# EasyEDA schematic SCH_jlh1969_2026-03-17.json
TITLE: Sheet_1; REV: 1.0; Date: 2026-02-05; Sheet: 1/1; Drawn By: emilio.mol.mar; Company: Your Company
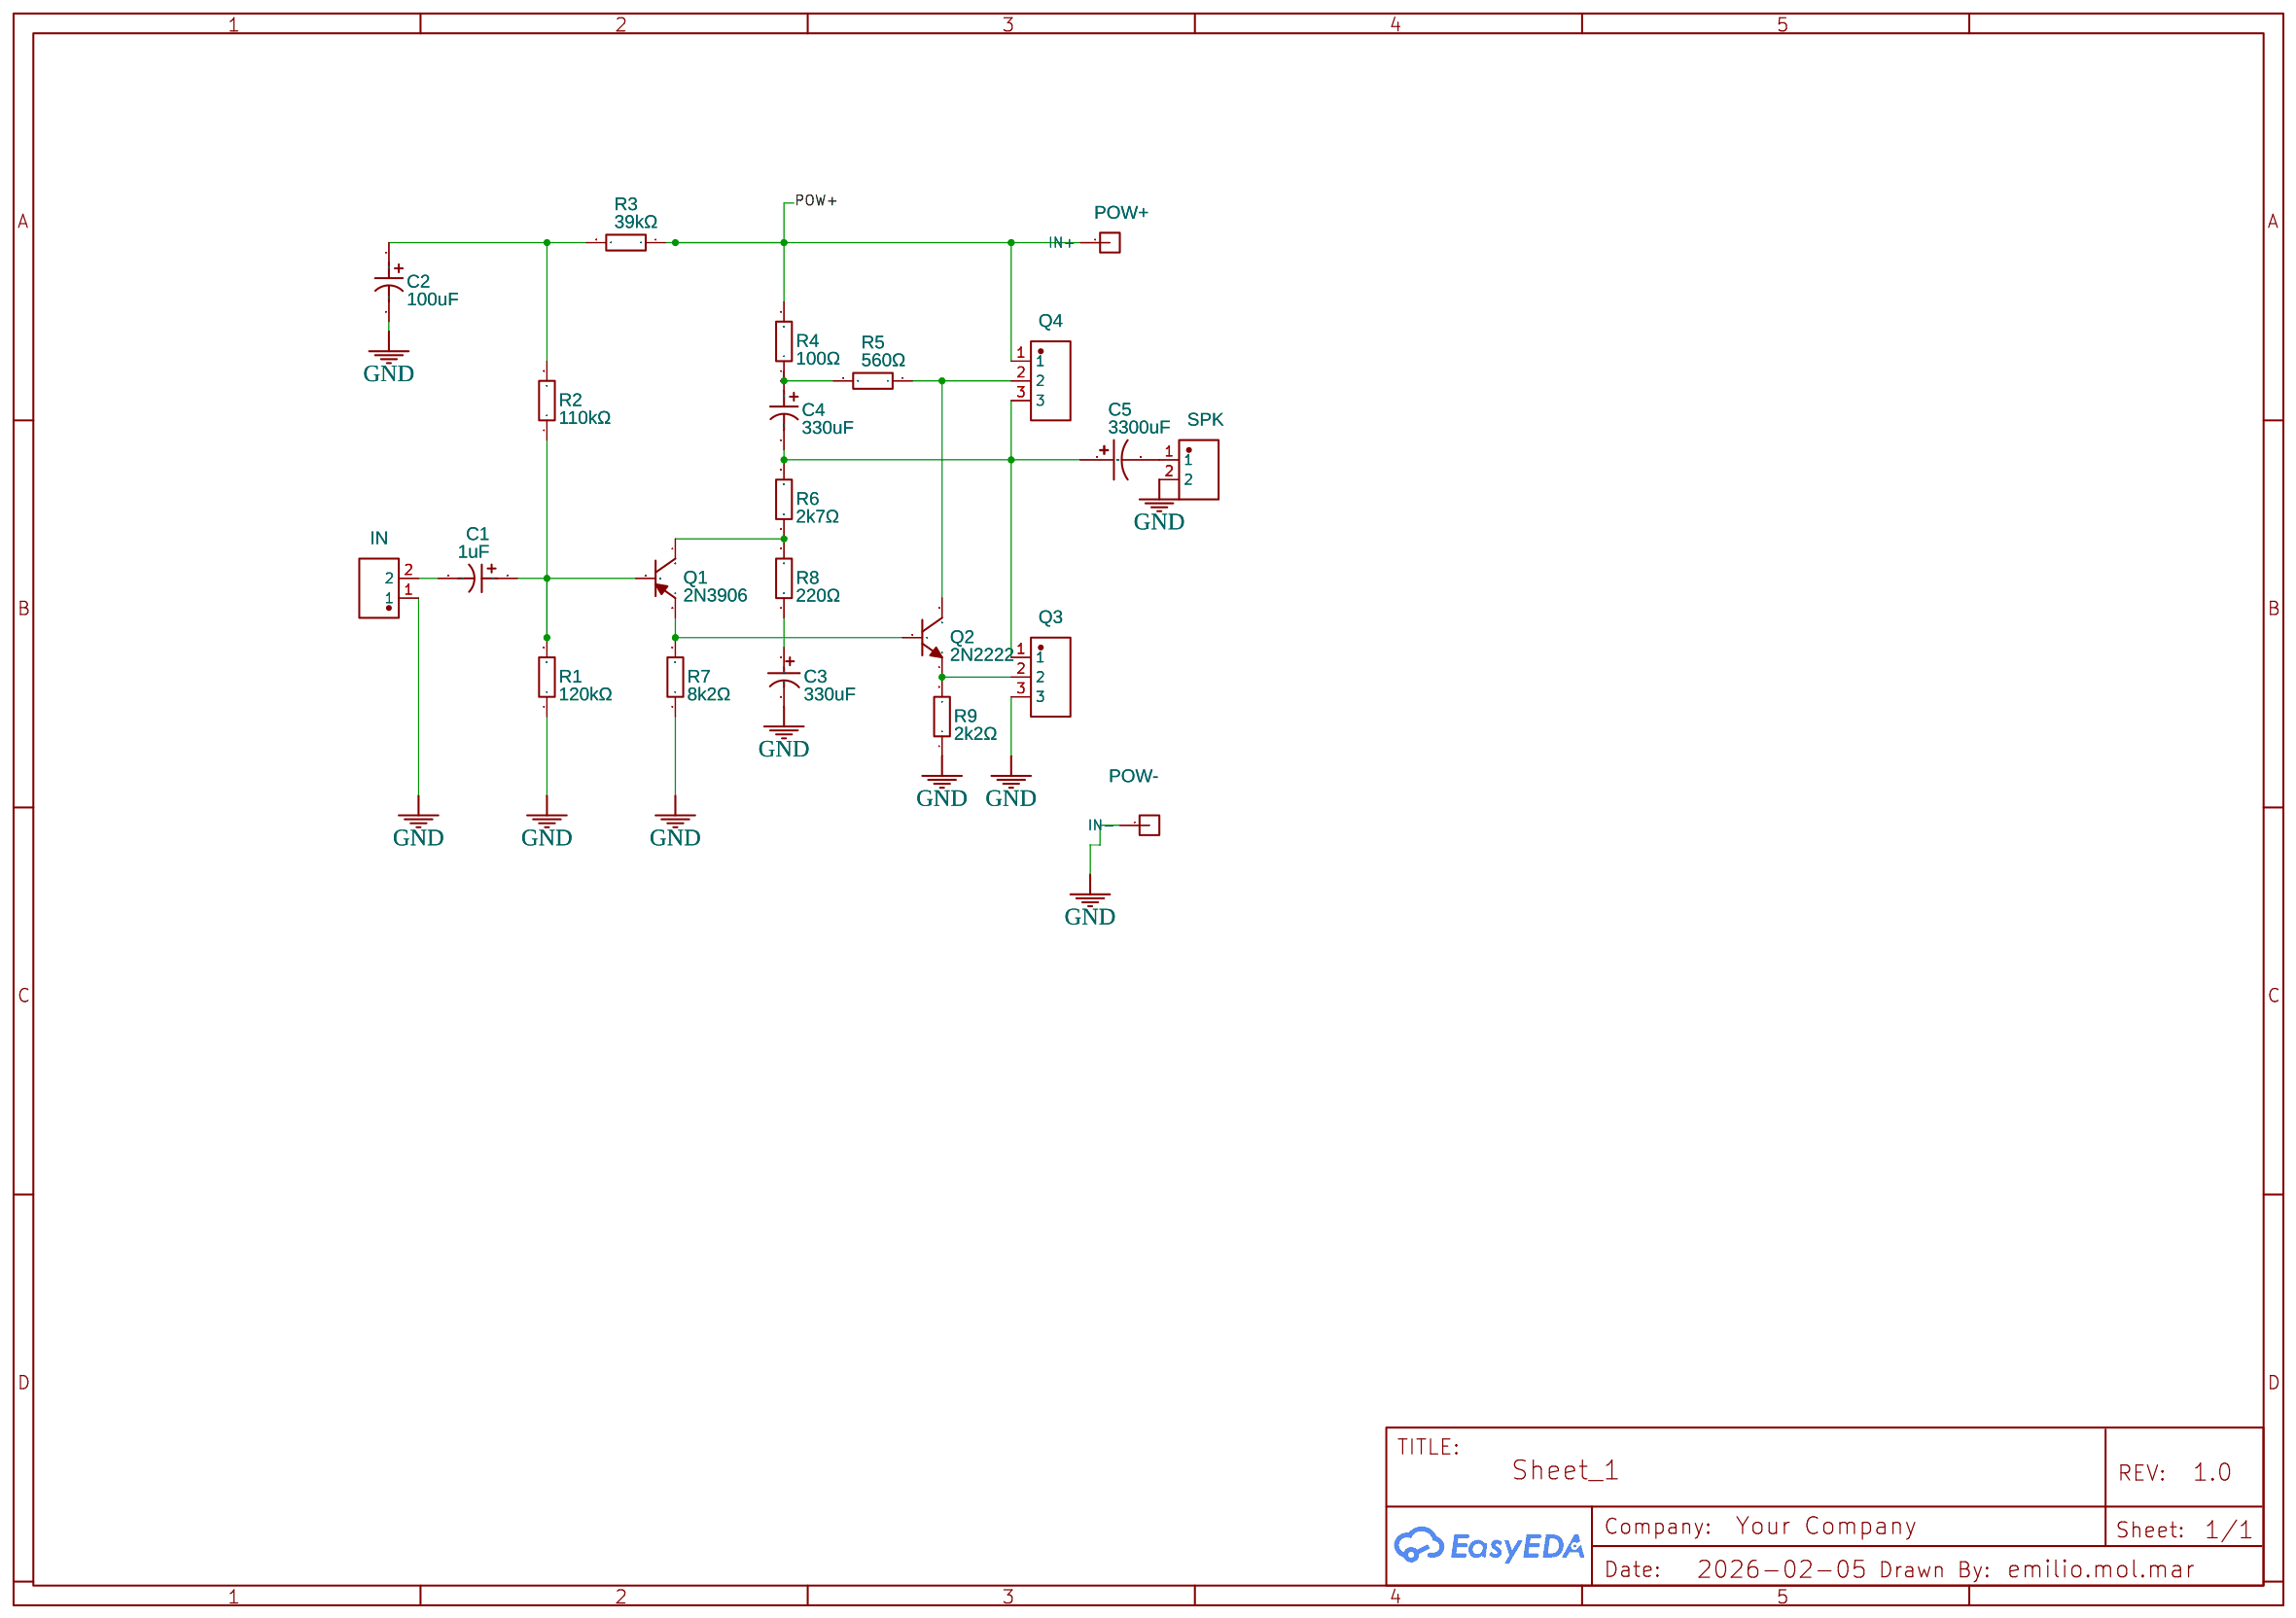
[diagram p0: schematic sheet]

## Parts
C1  1uF  [CAP-TH_BD5.0-P2.00-D0.5-FD-1]
C2  100uF  [CAP-TH_BD6.3-P2.50-D0.6-FD]
C3  330uF  [CAP-TH_BD8.0-P3.50-D0.6-FD]
C4  330uF  [CAP-TH_BD6.3-P2.50-D0.6-FD]
C5  3300uF  [CAP-TH_BD18.0-P7.50-D0.8-FD]
IN  XDZ200-1-02-Z-2.0-G1  [HDR-TH_2P-P2.00-V-M]
POW+  Buck_IN+  [HDR-TH_1P-P2.54-V-M]
POW-  Buck_IN-  [HDR-TH_1P-P2.54-V-M]
Q1  2N3906  [TO-92-3_L4.8-W3.7-P1.27-R-1]
Q2  2N2222  [TO-18-3_BD5.6_L14C1]
Q3  PEC03SAAN_C5708637  [HDR-TH_3P-P2.54-V-M-B]
Q4  PEC03SAAN_C5708637  [HDR-TH_3P-P2.54-V-M-B]
R1  120kΩ  [RES-TH_BD2.3-L6.5-P10.50-D0.5]
R2  110kΩ  [RES-TH_BD2.3-L6.5-P10.50-D0.5]
R3  39kΩ  [RES-TH_BD2.3-L6.5-P10.50-D0.5]
R4  100Ω  [RES-TH_BD2.3-L6.5-P10.50-D0.5]
R5  560Ω  [RES-TH_BD2.3-L6.5-P10.50-D0.5]
R6  2k7Ω  [RES-TH_BD2.3-L6.5-P10.50-D0.5]
R7  8k2Ω  [RES-TH_BD2.3-L6.5-P10.50-D0.5]
R8  220Ω  [RES-TH_BD2.3-L6.5-P10.50-D0.5]
R9  2k2Ω  [RES-TH_BD2.3-L6.5-P10.50-D0.5]
SPK  XDZ200-1-02-Z-2.0-G1  [HDR-TH_2P-P2.00-V-M]

## Library data of the parts
C1 = WL1H105M05011PC: Supplier: LCSC; Supplier Part: C20539361; Manufacturer: SAMWHA(三和); JLCPCB Part Class: Extended Part; Contributor: lcsc
C2 C4 = GR1V101M0611: Supplier: LCSC; Supplier Part: C2873964; Manufacturer: ROQANG(容强); Contributor: lcsc; JLCPCB Part Class: Extended Part
C3 = 25YXF220MEFCT78X11.5: Supplier: LCSC; Manufacturer: Rubycon(红宝石); Supplier Part: C88746; JLCPCB Part Class: Extended Part
C5 = 35YXF3300MEFCGC18X35.5: Contributor: lcsc; Supplier: LCSC; Supplier Part: C5114817; Manufacturer: Rubycon(红宝石); JLCPCB Part Class: Extended Part
IN SPK = XDZ200-1-02-Z-2.0-G1: Supplier: LCSC; Supplier Part: C19190938; Manufacturer: XUNDA(讯答); Contributor: lcsc; JLCPCB Part Class: Extended Part
POW+ POW- = Header_1Pin: Supplier Part: C2977589; Supplier: LCSC; Contributor: guillaume.de.s
Q1 = 2N3906_C2980868: Contributor: LCSC; Supplier: LCSC; Supplier Part: C2980868; Manufacturer: Slkor(萨科微); JLCPCB Part Class: Extended Part
Q2 = 2N2222_C6996955: Supplier: LCSC; Supplier Part: C6996955; Manufacturer: Solid State System; Contributor: lcsc
Q3 Q4 = PEC03SAAN_C5708637: Supplier: LCSC; Supplier Part: C5708637; Manufacturer: Sullins; Manufacturer Part: PEC03SAAN; JLCPCB Part Class: Extended Part; Contributor: lcsc
R1-R9 = CF1/4W-110KΩ±5% T52: Contributor: LCSC; Supplier: LCSC; Supplier Part: C120104; Manufacturer: CCO(千志电子); JLCPCB Part Class: Extended Part

## Nets
GND: C2.2 C3.2 IN.1 POW-.1(IN-) Q3.3 R1.1 R7.1 R9.1 SPK.2
POW+: POW+.1(IN+) Q4.1 R3.1 R4.2
Net-(C1-1): C1.1 Q1.2(B) R1.2 R2.1
Net-(C1-2): C1.2 IN.2
Net-(C2-1): C2.1 R2.2 R3.2
Net-(C3-1): C3.1 R8.1
Net-(C4-1): C4.1 R4.1 R5.2
Net-(C4-2): C4.2 C5.1 Q3.1 Q4.3 R6.2
Net-(C5-2): C5.2 SPK.1
Net-(Q1-1): Q1.1(C) R6.1 R8.2
Net-(Q1-3): Q1.3(E) Q2.2(B) R7.2
Net-(Q2-1): Q2.1(E) Q3.2 R9.2
Net-(Q2-3): Q2.3(C) Q4.2 R5.1
